# EAGLE design electrode_tester (EAGLE 9.1.3)
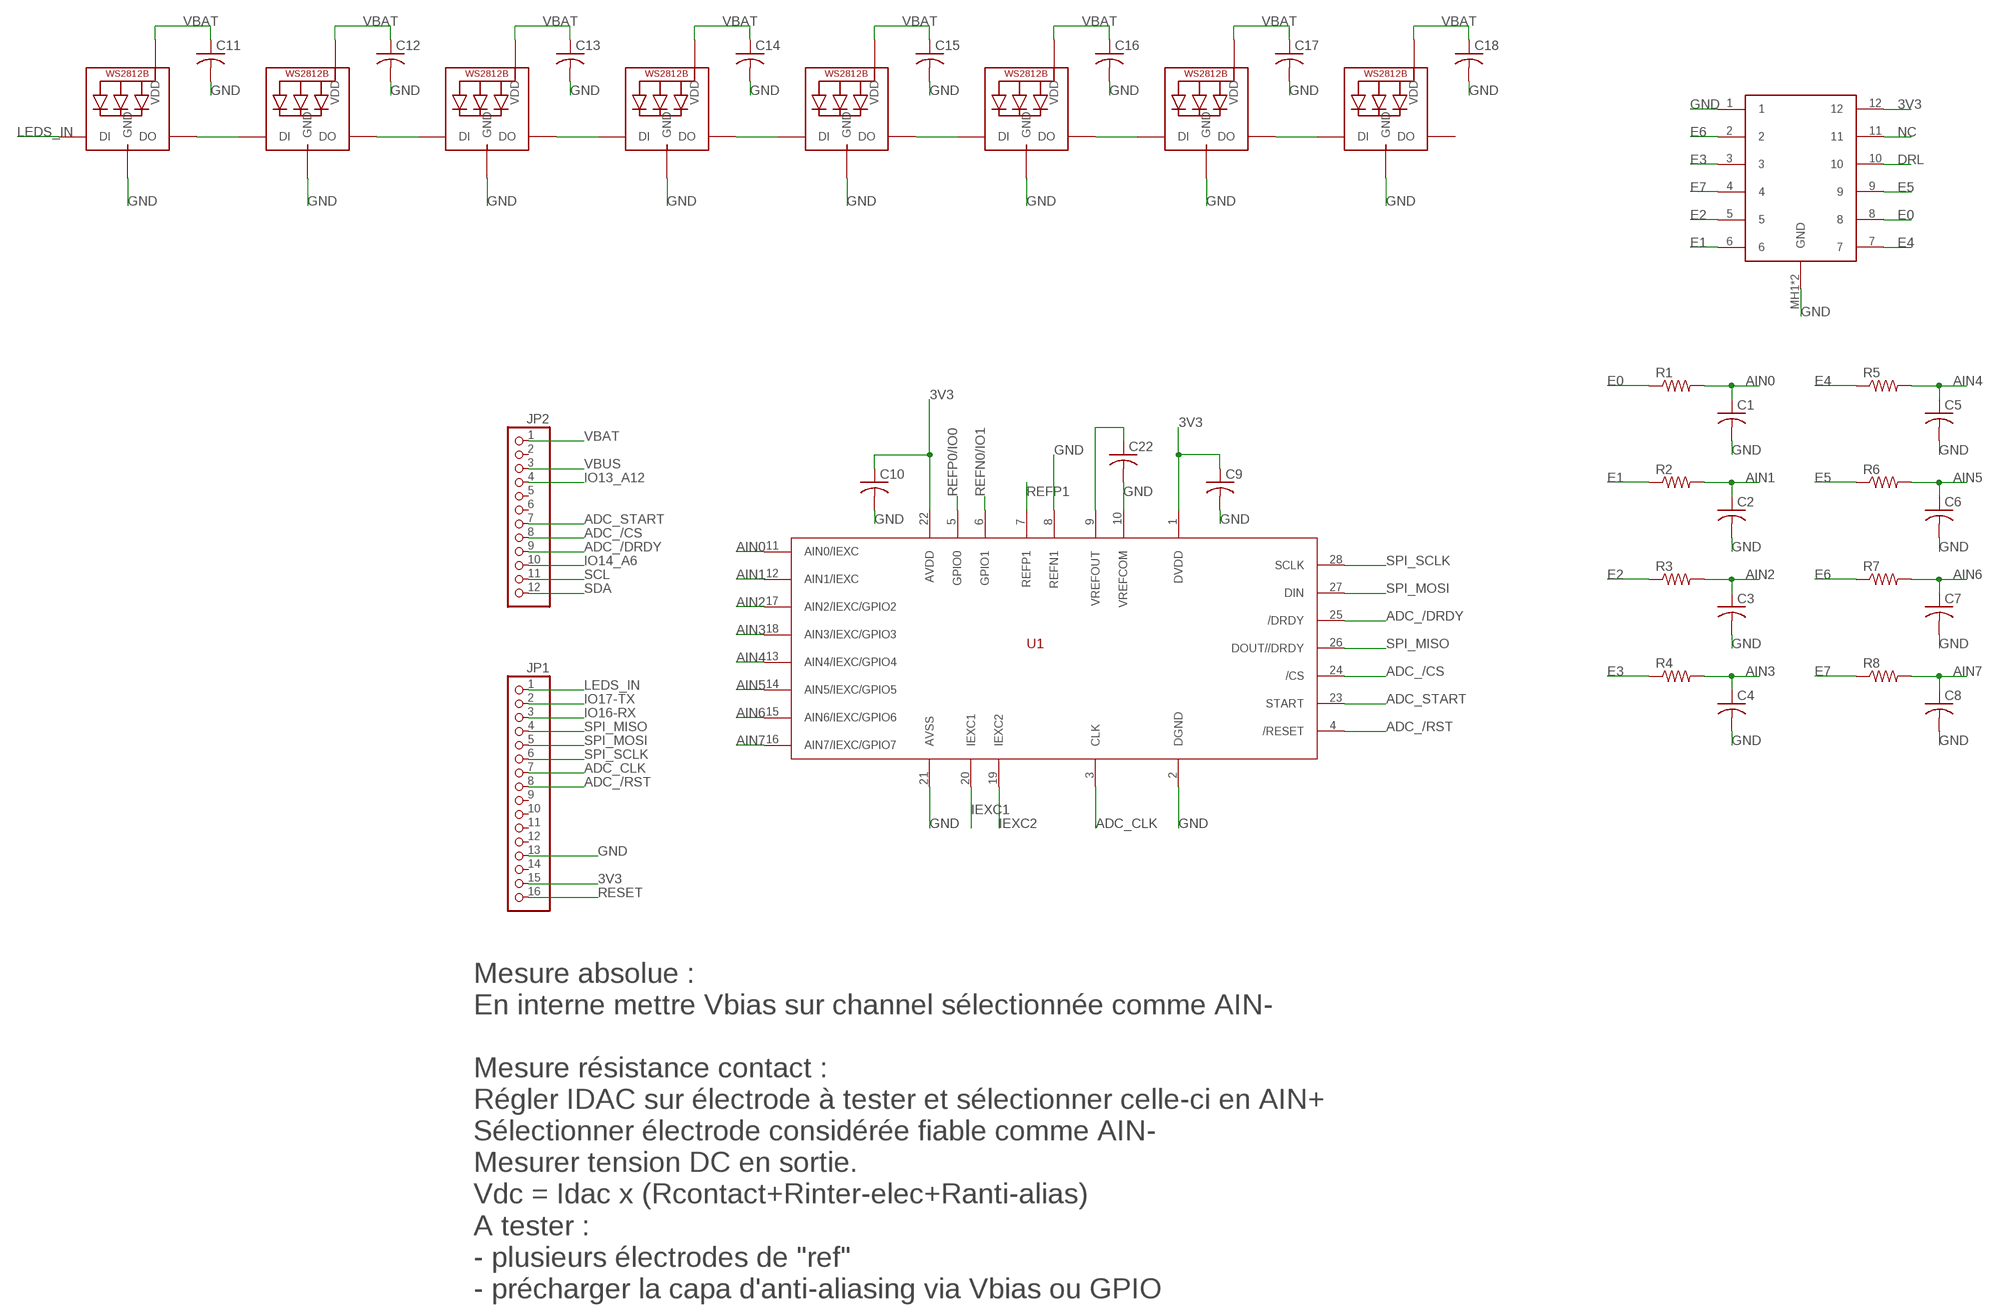
[diagram p0: schematic, sheet 1, part 1 of 2]
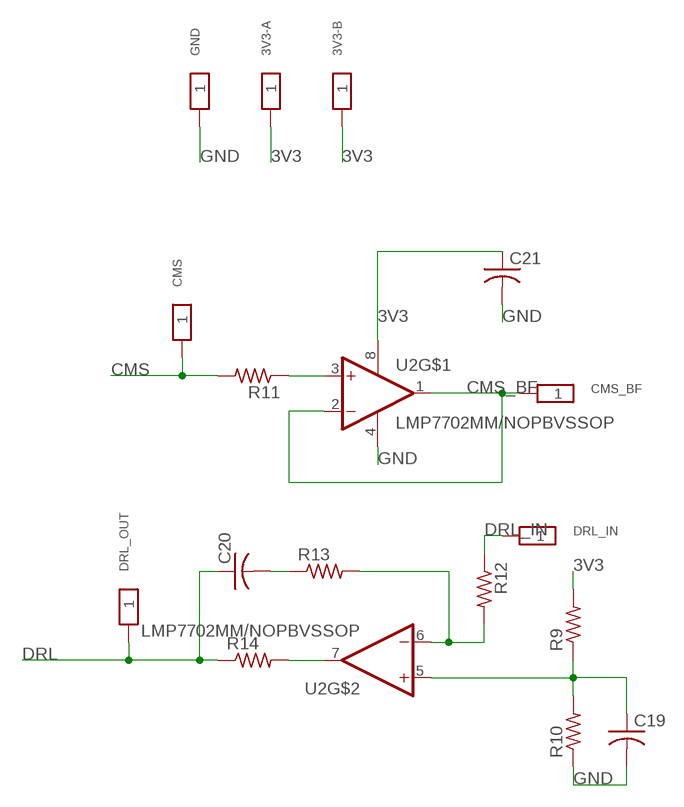
[diagram p1: schematic, sheet 1, part 2 of 2]

## Parts
3V3-A  TESTPAD_PROG  [TP1.5MM]
3V3-B  TESTPAD_PROG  [TP1.5MM]
C1  C-USC0603  [C0603]
C2  C-USC0603  [C0603]
C3  C-USC0603  [C0603]
C4  C-USC0603  [C0603]
C5  C-USC0603  [C0603]
C6  C-USC0603  [C0603]
C7  C-USC0603  [C0603]
C8  C-USC0603  [C0603]
C9  C-USC0603  [C0603]
C10  C-USC0603  [C0603]
C11  C-USC0603  [C0603]
C12  C-USC0603  [C0603]
C13  C-USC0603  [C0603]
C14  C-USC0603  [C0603]
C15  C-USC0603  [C0603]
C16  C-USC0603  [C0603]
C17  C-USC0603  [C0603]
C18  C-USC0603  [C0603]
C19  C-USC0603  [C0603]
C20  C-USC0603  [C0603]
C21  C-USC0603  [C0603]
C22  C-USC0603  [C0603]
CMS  TESTPAD_PROG  [TP1.5MM]
CMS_BF  TESTPAD_PROG  [TP1.5MM]
CONN1  505110-1292  [505110-1292]
DRL_IN  TESTPAD_PROG  [TP1.5MM]
DRL_OUT  TESTPAD_PROG  [TP1.5MM]
GND  TESTPAD_PROG  [TP1.5MM]
JP1  HEADER-1X16ROUND  [1X16_ROUND]
JP2  HEADER-1X12  [1X12_ROUND]
LED1  WS2812B5050  [WS2812B]
LED2  WS2812B5050  [WS2812B]
LED3  WS2812B5050  [WS2812B]
LED4  WS2812B5050  [WS2812B]
LED5  WS2812B5050  [WS2812B]
LED6  WS2812B5050  [WS2812B]
LED7  WS2812B5050  [WS2812B]
LED8  WS2812B5050  [WS2812B]
R1  R-US_R0603  [R0603]
R2  R-US_R0603  [R0603]
R3  R-US_R0603  [R0603]
R4  R-US_R0603  [R0603]
R5  R-US_R0603  [R0603]
R6  R-US_R0603  [R0603]
R7  R-US_R0603  [R0603]
R8  R-US_R0603  [R0603]
R9  R-US_R0603  [R0603]
R10  R-US_R0603  [R0603]
R11  R-US_R0603  [R0603]
R12  R-US_R0603  [R0603]
R13  R-US_R0603  [R0603]
R14  R-US_R0603  [R0603]
U1  ADS1248  [TSSOP28]
U2  LMP7702MM/NOPBVSSOP  [VSSOP8]

## Nets
3V3: 3V3-A.1 3V3-B.1 C9.1 C10.1 C21.1 CONN1.12 JP1.15 R9.2 U1.1(DVDD) U1.22(AVDD) U2.8(V+)
ADC_/CS: JP2.8 U1.24(/CS)
ADC_/DRDY: JP2.9 U1.25(/DRDY)
ADC_/RST: JP1.8 U1.4(/RESET)
ADC_CLK: JP1.7 U1.3(CLK)
ADC_START: JP2.7 U1.23(START)
AIN0: C1.1 R1.2 U1.11(AIN0/IEXC)
AIN1: C2.1 R2.2 U1.12(AIN1/IEXC)
AIN2: C3.1 R3.2 U1.17(AIN2/IEXC/GPIO2)
AIN3: C4.1 R4.2 U1.18(AIN3/IEXC/GPIO3)
AIN4: C5.1 R5.2 U1.13(AIN4/IEXC/GPIO4)
AIN5: C6.1 R6.2 U1.14(AIN5/IEXC/GPIO5)
AIN6: C7.1 R7.2 U1.15(AIN6/IEXC/GPIO6)
AIN7: C8.1 R8.2 U1.16(AIN7/IEXC/GPIO7)
CMS: CMS.1 R11.2
CMS_BF: CMS_BF.1 U2.1(OUT) U2.2(-IN)
DRL: C20.1 CONN1.10 DRL_OUT.1 R14.1
DRL_IN: DRL_IN.1 R12.1
E0: CONN1.8 R1.1
E1: CONN1.6 R2.1
E2: CONN1.5 R3.1
E3: CONN1.3 R4.1
E4: CONN1.7 R5.1
E5: CONN1.9 R6.1
E6: CONN1.2 R7.1
E7: CONN1.4 R8.1
GND: C1.2 C2.2 C3.2 C4.2 C5.2 C6.2 C7.2 C8.2 C9.2 C10.2 C11.2 C12.2 C13.2 C14.2 C15.2 C16.2 C17.2 C18.2 C19.2 C21.2 C22.2 CONN1.1 CONN1.MH1(GND) CONN1.MH2(GND) GND.1 JP1.13 LED1.3-GND(GND) LED2.3-GND(GND) LED3.3-GND(GND) LED4.3-GND(GND) LED5.3-GND(GND) LED6.3-GND(GND) LED7.3-GND(GND) LED8.3-GND(GND) R10.1 U1.2(DGND) U1.8(REFN1) U1.10(VREFCOM) U1.21(AVSS) U2.4(V-)
IEXC1: U1.20(IEXC1)
IEXC2: U1.19(IEXC2)
IO13_A12: JP2.4
IO14_A6: JP2.10
IO16-RX: JP1.3
IO17-TX: JP1.2
LEDS_IN: JP1.1 LED1.4-DIN(DI)
N$1: LED1.2-DOUT(DO) LED2.4-DIN(DI)
N$2: LED2.2-DOUT(DO) LED3.4-DIN(DI)
N$3: LED3.2-DOUT(DO) LED4.4-DIN(DI)
N$4: LED4.2-DOUT(DO) LED5.4-DIN(DI)
N$5: LED5.2-DOUT(DO) LED6.4-DIN(DI)
N$6: LED6.2-DOUT(DO) LED7.4-DIN(DI)
N$7: LED7.2-DOUT(DO) LED8.4-DIN(DI)
N$8: R11.1 U2.3(+IN)
N$9: C22.1 U1.9(VREFOUT)
N$12: R12.2 R13.2 U2.6(-IN)
N$14: C20.2 R13.1
N$15: R14.2 U2.7(OUT)
N$16: C19.1 R9.1 R10.2 U2.5(+IN)
NC: CONN1.11
REFN0/IO1: U1.6(GPIO1)
REFP0/IO0: U1.5(GPIO0)
REFP1: U1.7(REFP1)
RESET: JP1.16
SCL: JP2.11
SDA: JP2.12
SPI_MISO: JP1.4 U1.26(DOUT//DRDY)
SPI_MOSI: JP1.5 U1.27(DIN)
SPI_SCLK: JP1.6 U1.28(SCLK)
VBAT: C11.1 C12.1 C13.1 C14.1 C15.1 C16.1 C17.1 C18.1 JP2.1 LED1.1-VDD(VDD) LED2.1-VDD(VDD) LED3.1-VDD(VDD) LED4.1-VDD(VDD) LED5.1-VDD(VDD) LED6.1-VDD(VDD) LED7.1-VDD(VDD) LED8.1-VDD(VDD)
VBUS: JP2.3
Unconnected: JP1.9 JP1.10 JP1.11 JP1.12 JP1.14 JP2.2 JP2.5 JP2.6 LED8.2-DOUT(DO)

## Notes on the sheet
- Mesure absolue :
  En interne mettre Vbias sur channel sélectionnée comme AIN-
  
  Mesure résistance contact :
  Régler IDAC sur électrode à tester et sélectionner celle-ci en AIN+
  Sélectionner électrode considérée fiable comme AIN-
  Mesurer tension DC en sortie.
  Vdc = Idac x (Rcontact+Rinter-elec+Ranti-alias)
  A tester : 
  - plusieurs électrodes de "ref"
  - précharger la capa d'anti-aliasing via Vbias ou GPIO

## Library data of the parts
3V3-A 3V3-B CMS CMS_BF DRL_IN DRL_OUT GND = electrode_tester:TESTPAD_PROG: TESTPAD
C1-C22 = electrode_tester:C-US: CAPACITOR, American symbol; SPICEPREFIX: C
CONN1 = electrode_tester:505110-1292
JP1 = electrode_tester:HEADER-1X16: PIN HEADER
JP2 = electrode_tester:HEADER-1X12
LED1-LED8 = electrode_tester:WS2812B
R1-R14 = electrode_tester:R-US_: RESISTOR, American symbol; SPICEPREFIX: R
U1 = electrode_tester:ADS1248
U2 = electrode_tester:LMP7702MM/NOPB: Op Amps Prec RRIO 12V Dual Op Amp; DESCRIPTION: Op Amps Prec RRIO 12V Dual Op Amp; MF: Texas Instruments; MP: LMP7702MM/NOPB; PACKAGE: MSOP-8

## Board
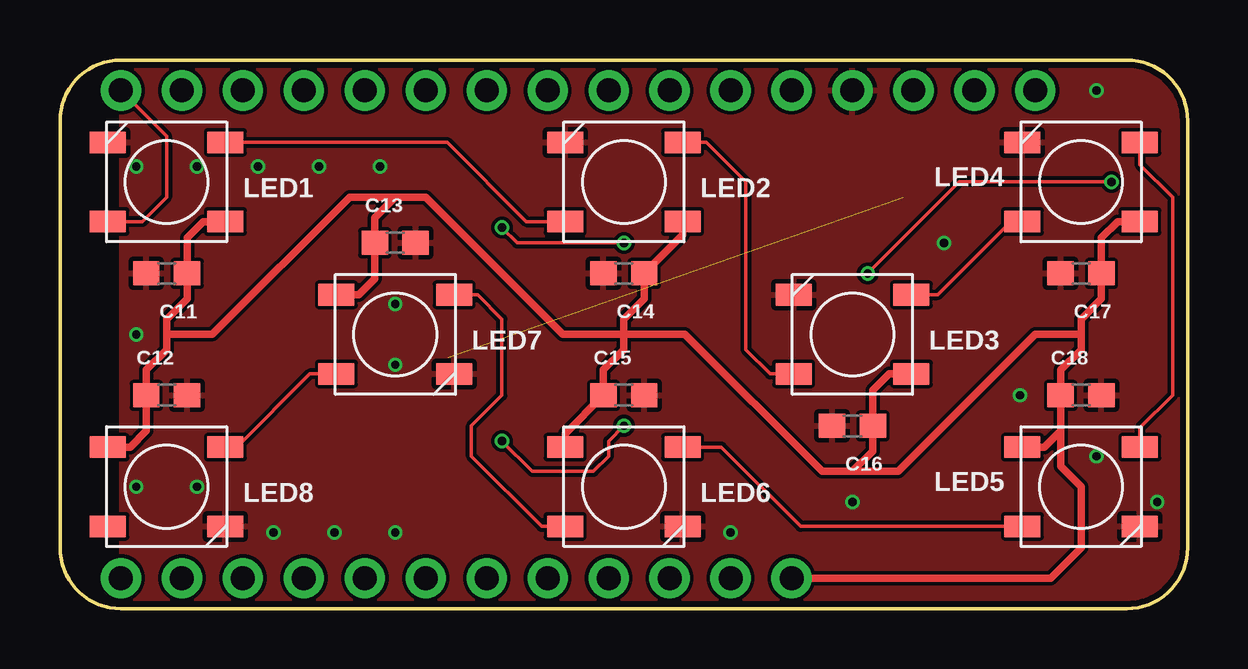
[diagram p2: board, top side]
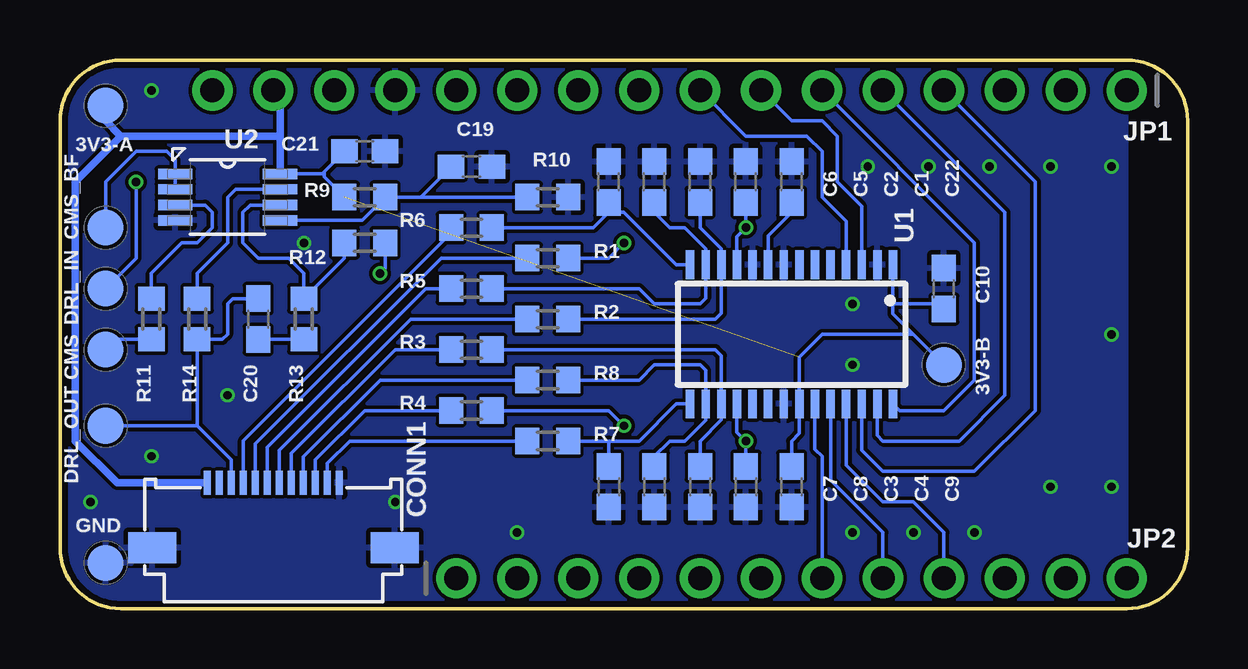
[diagram p3: board, bottom side, seen from below]

Size 46.99 x 22.86 mm. Coordinates in mm from the lower left corner, seen from the top.
Outline: 2.54,0 arc-90 0,2.54 0,20.32 arc-90 2.54,22.86 44.45,22.86 arc-90 46.99,20.32 46.99,2.54 arc-90 44.45,0 2.54,0
Copper layers (1*16): Top 0.018mm / dielectric 1.55mm / Bottom 0.018mm
Design rules "eC_2Layer_PClass6_BaseCopperO18_eCDefault": minimum track width 0.15mm, minimum drill 0.35mm, track to track 0.15mm, track to pad 0.15mm, pad to pad 0.15mm, via to via 0.15mm, smd to smd 0mil, copper to edge 0.25mm, drill to drill 0.35mm, minimum pad ring 0.175mm, minimum via ring 0.125mm, stop-mask expansion 0mil, vias tented up to drill 0.45mm, thermal gap 0.2mm

### Footprints (pad centres in the part's own frame; a part is rotated, then mirrored left to right if it is on the bottom)
TP1.5MM = smd 1.5 x 1.5: 1 0,0
C0603 = smd 1.1 x 1: 1 -0.85,0; 2 0.85,0
505110-1292 = smd 0.3 x 1: 1 -2.75,-2.7; 2 -2.25,-2.7; 3 -1.75,-2.7; 4 -1.25,-2.7; 5 -0.75,-2.7; 6 -0.25,-2.7; 7 0.25,-2.7; 8 0.75,-2.7; 9 1.25,-2.7; 10 1.75,-2.7; 11 2.25,-2.7; 12 2.75,-2.7 | smd 2 x 1.3: MH1 -5.05,0; MH2 5.05,0
1X16_ROUND = drill 1 pad 1.676: 1 -19.05,0; 2 -16.51,0; 3 -13.97,0; 4 -11.43,0; 5 -8.89,0; 6 -6.35,0; 7 -3.81,0; 8 -1.27,0; 9 1.27,0; 10 3.81,0; 11 6.35,0; 12 8.89,0; 13 11.43,0; 14 13.97,0; 15 16.51,0; 16 19.05,0
1X12_ROUND = drill 1 pad 1.676: 1 -13.97,0; 2 -11.43,0; 3 -8.89,0; 4 -6.35,0; 5 -3.81,0; 6 -1.27,0; 7 1.27,0; 8 3.81,0; 9 6.35,0; 10 8.89,0; 11 11.43,0; 12 13.97,0
WS2812B = smd 1.5 x 0.9: 1-VDD 2.45,-1.65; 2-DOUT 2.45,1.65; 3-GND -2.45,1.65; 4-DIN -2.45,-1.65
R0603 = smd 1 x 1.1: 1 -0.85,0; 2 0.85,0
TSSOP28 = smd 0.35 x 1.2: 1 -4.225,-2.9; 2 -3.575,-2.9; 3 -2.925,-2.9; 4 -2.275,-2.9; 5 -1.625,-2.9; 6 -0.975,-2.9; 7 -0.325,-2.9; 8 0.325,-2.9; 9 0.975,-2.9; 10 1.625,-2.9; 11 2.275,-2.9; 12 2.925,-2.9; 13 3.575,-2.9; 14 4.225,-2.9; 15 4.225,2.9; 16 3.575,2.9; 17 2.925,2.9; 18 2.275,2.9; 19 1.625,2.9; 20 0.975,2.9; 21 0.325,2.9; 22 -0.325,2.9; 23 -0.975,2.9; 24 -1.625,2.9; 25 -2.275,2.9; 26 -2.925,2.9; 27 -3.575,2.9; 28 -4.225,2.9
VSSOP8 = smd 1.422 x 0.432: 1 -2.184,0.965; 2 -2.184,0.33; 3 -2.184,-0.33; 4 -2.184,-0.965; 5 2.184,-0.965; 6 2.184,-0.33; 7 2.184,0.33; 8 2.184,0.965

### Placement (x,y rotation side)
3V3-A  45.09,20.95 0 bottom
3V3-B  10.16,10.16 0 bottom
C1  18.42,17.78 90 bottom
C2  20.32,17.78 90 bottom
C3  20.32,5.08 270 bottom
C4  18.42,5.08 270 bottom
C5  22.23,17.78 90 bottom
C6  24.13,17.78 90 bottom
C7  24.13,5.08 270 bottom
C8  22.23,5.08 270 bottom
C9  16.51,5.08 270 bottom
C10  10.16,13.34 90 bottom
C11  4.45,13.97 180 top
C12  4.45,8.89 0 top
C13  13.97,15.24 0 top
C14  23.5,13.97 180 top
C15  23.5,8.89 0 top
C16  33.02,7.62 180 top
C17  42.54,13.97 180 top
C18  42.54,8.89 0 top
C19  29.85,18.41 0 bottom
C20  38.73,12.06 270 bottom
C21  34.29,19.05 0 bottom
C22  16.51,17.78 90 bottom
CMS  45.09,10.79 0 bottom
CMS_BF  45.09,15.88 0 bottom
CONN1  38.1,2.54 180 bottom
DRL_IN  45.09,13.34 0 bottom
DRL_OUT  45.09,7.62 0 bottom
GND  45.09,1.91 0 bottom
JP1  21.59,21.59 180 bottom
JP2  16.51,1.27 0 bottom
LED1  4.45,17.78 0 top
LED2  23.5,17.78 0 top
LED3  33.02,11.43 0 top
LED4  42.54,17.78 0 top
LED5  42.54,5.08 180 top
LED6  23.5,5.08 180 top
LED7  13.97,11.43 180 top
LED8  4.45,5.08 180 top
R1  26.67,14.61 0 bottom
R2  26.67,12.06 0 bottom
R3  29.85,10.79 0 bottom
R4  29.85,8.26 0 bottom
R5  29.85,13.34 0 bottom
R6  29.85,15.88 0 bottom
R7  26.67,6.99 0 bottom
R8  26.67,9.53 0 bottom
R9  34.29,17.14 180 bottom
R10  26.67,17.14 180 bottom
R11  43.18,12.06 270 bottom
R12  34.29,15.24 180 bottom
R13  36.83,12.06 90 bottom
R14  41.27,12.06 90 bottom
U1  16.51,11.43 180 bottom
U2  40,17.14 0 bottom

### Tracks (layer width: path | path; a pad name or v marks a point on that pad's centre or on a via)
3V3  (1 unrouted)
  Bottom 0.152: 36.08,18.11 U2.8 36.08,18.11 | 36.08,18.11 35.98,18.2 | 35.98,18.2 C21.1 | 35.98,18.2 35.98,17.99 R9.2 | U1.1 12.28,12.7 | 12.28,12.7 12.28,12.29 11.43,11.43 | 11.43,11.43 15.24,11.43 16.19,10.48 U1.22 16.19,7.31 16.51,6.99 C9.1 | 11.43,11.43 3V3-B.1 | C10.1 10.38,12.7 12.28,12.7
  Bottom 0.305: CONN1.12 44.61,5.24 46.35,6.99 46.35,17.78 | 46.35,17.78 44.45,19.68 | 37.82,19.68 38.1,19.68 | 38.1,19.68 44.45,19.68 | 37.82,19.68 U2.8 | 44.45,19.68 45.09,20.32 | 45.09,20.32 3V3-A.1 | 37.82,19.68 44.45,19.68 | 37.82,19.68 U2.8 | 46.35,17.78 44.45,19.68 | 44.45,19.68 45.09,20.32 | 37.82,19.68 U2.8 | 37.82,19.68 38.1,19.68 | 38.1,19.68 44.45,19.68 | 37.82,19.68 44.45,19.68 | 37.82,19.68 37.82,21.31 JP1.15
ADC_/CS
  Bottom 0.152: U1.24 14.88,5.36 12.7,3.17 JP2.8
ADC_/DRDY
  Bottom 0.152: U1.25 14.24,5.98 12.7,4.45 11.43,4.45 10.16,3.17 JP2.9
ADC_/RST
  Bottom 0.152: U1.4 14.24,16.14 15.24,17.14 15.24,19.05 15.87,19.68 18.42,19.68 JP1.8
ADC_CLK
  Bottom 0.152: U1.3 13.58,16.76 14.6,17.78 14.6,19.68 15.24,20.32 16.51,20.32 JP1.7
ADC_START
  Bottom 0.152: U1.23 15.53,6.64 15.24,6.35 JP2.7
AIN0  (via drill 0.35)
  Top 0.152: v18.42,15.88 19.05,15.24 v23.5,15.24
  Bottom 0.152: U1.11 18.79,15.51 v18.42,15.88 C1.1 | v23.5,15.24 24.13,14.61 R1.2
AIN1
  Bottom 0.152: R2.2 19.69,12.06 19.44,12.31 U1.12 19.44,14.99 20.32,15.88 C2.1
AIN2
  Bottom 0.152: R3.2 19.69,10.79 19.44,10.54 U1.17 19.44,7.87 20.32,6.99 C3.1
AIN3  (via drill 0.35)
  Top 0.152: v18.42,6.99 19.69,5.71 20.96,5.71 22.23,5.71 22.86,6.35 22.86,6.99 v23.5,7.62
  Bottom 0.152: U1.18 18.79,7.36 v18.42,6.99 C4.1 | v23.5,7.62 24.13,8.26 R4.2
AIN4
  Bottom 0.152: R5.2 22.86,13.34 22.23,12.7 20.32,12.7 20.09,12.94 U1.13 20.09,15.01 20.96,15.88 21.59,15.88 22.23,16.51 C5.1
AIN5
  Bottom 0.152: R6.2 24.77,15.88 24.13,16.51 C6.1 23.71,16.51 23.5,16.51 21.32,14.33 U1.14
AIN6
  Bottom 0.152: R7.2 24.13,6.99 | 24.13,6.99 22.86,6.99 21.32,8.53 U1.15 | C7.1 24.13,6.99
AIN7
  Bottom 0.152: R8.2 22.86,9.53 22.23,10.16 20.32,10.16 20.09,9.93 U1.16 20.09,7.86 20.96,6.99 21.59,6.99 22.23,6.35 C8.1
CMS
  Bottom 0.152: R11.2 44.66,11.21 CMS.1
CMS_BF
  Bottom 0.152: U2.2 U2.1 42.19,18.69 42.54,19.05 43.81,19.05 45.09,17.78 CMS_BF.1
DRL
  Bottom 0.152: CONN1.10 39.85,6.2 41.27,7.62 | DRL_OUT.1 41.27,7.62 | 41.27,7.62 R14.1 40.22,11.21 40,11.43 40,12.7 39.79,12.91 C20.1
DRL_IN  (via drill 0.35)
  Top 0.152: v43.81,17.78 37.46,17.78 v33.66,13.97
  Bottom 0.152: v33.66,13.97 33.44,14.19 R12.1 | DRL_IN.1 43.81,14.61 v43.81,17.78
E0
  Bottom 0.152: R1.1 31.11,14.61 38.85,6.87 CONN1.8
E1
  Bottom 0.152: CONN1.6 37.85,6.6 32.38,12.06 R2.1
E2
  Bottom 0.152: CONN1.5 37.35,6.46 33.02,10.79 R3.1
E3
  Bottom 0.152: CONN1.3 36.35,6.2 34.29,8.26 R4.1
E4
  Bottom 0.152: R5.1 31.75,13.34 38.35,6.74 CONN1.7
E5
  Bottom 0.152: R6.1 30.7,15.46 30.9,15.46 39.35,7 CONN1.9
E6
  Bottom 0.152: CONN1.2 35.85,6.06 34.92,6.99 R7.1
E7
  Bottom 0.152: CONN1.4 36.85,6.33 33.66,9.53 R8.1
GND  (via drill 0.35)
  other vias: 13.97,10.16 13.97,12.7 13.97,3.17 11.43,3.17 10.79,18.41 8.25,18.41 8.89,3.17 3.18,18.41 3.18,11.43 5.71,18.41 43.18,21.59 36.83,15.24 40,8.89 43.18,6.35 13.33,18.41 3.18,5.08 5.71,5.08 33.02,4.45 27.94,3.17 45.72,4.45
  pour Bottom: 47.62,23.5 2.54,23.5 2.54,-0.64 47.62,-0.64
  pour Top: 47.62,23.5 47.62,-0.64 2.54,-0.64 2.54,23.5
LEDS_IN
  Top 0.152: LED1.4-DIN 3.43,16.13 4.45,17.14 4.45,19.68 JP1.1
N$1
  Top 0.152: LED1.2-DOUT 16.13,19.43 19.43,16.13 LED2.4-DIN
N$2
  Top 0.152: LED2.2-DOUT 26.93,19.43 28.57,17.78 28.57,10.79 29.59,9.78 LED3.4-DIN
N$3
  Top 0.152: LED4.4-DIN 40.09,15.96 39.46,15.96 36.57,13.08 LED3.2-DOUT
N$4
  Top 0.152: LED4.2-DOUT 44.99,18.5 46.35,17.14 46.35,8.89 44.99,7.53 LED5.4-DIN
N$5
  Top 0.152: LED5.2-DOUT 30.86,3.43 27.56,6.73 LED6.4-DIN
N$6
  Top 0.152: LED6.2-DOUT 20.07,3.43 17.14,6.35 17.14,7.62 18.42,8.89 18.42,12.06 17.4,13.08 LED7.4-DIN
N$7
  Top 0.152: LED7.2-DOUT 10.41,9.78 7.37,6.73 LED8.4-DIN
N$8
  Bottom 0.152: U2.3 40.95,16.82 40.64,16.51 40.64,15.88 41.27,15.24 41.91,15.24 43.18,13.97 R11.1
N$9
  Bottom 0.152: U1.9 17.49,15.54 16.51,16.51 C22.1
N$12
  Bottom 0.152: R12.2 35.14,14.61 R13.2 36.83,13.97 37.46,14.61 38.73,14.61 39.37,15.24 39.37,16.51 39.06,16.82 U2.6
N$14
  Bottom 0.152: C20.2 R13.1
N$15
  Bottom 0.152: U2.7 39.67,17.48 40,17.14 40,15.24 41.27,13.97 R14.2
N$16
  Bottom 0.152: 31.96,17.14 R9.1 34.41,16.18 U2.5 | 31.96,17.14 R10.2 | C19.1 31.96,17.14
SPI_MISO
  Bottom 0.152: U1.26 13.58,6.6 12.7,5.71 8.89,5.71 6.35,8.26 6.35,17.78 JP1.4
SPI_MOSI
  Bottom 0.152: U1.27 12.94,7.22 12.7,6.99 9.53,6.99 7.62,8.89 7.62,16.51 JP1.5
SPI_SCLK
  Bottom 0.152: U1.28 12.01,8.26 10.16,8.26 8.89,9.53 8.89,15.24 JP1.6
VBAT
  Top 0.305: 23.5,11.43 20.96,11.43 15.24,17.14 13.97,17.14 | 23.5,11.43 26.04,11.43 31.75,5.71 33.02,5.71 | 33.02,5.71 34.92,5.71 40.64,11.43 42.54,11.43 | 13.97,17.14 12.06,17.14 6.35,11.43 4.45,11.43 | 4.45,11.43 4.45,12.06 5.29,12.91 C11.1 5.29,15.46 5.97,16.13 LED1.1-VDD | 4.45,11.43 4.45,10.79 3.6,9.95 C12.1 3.6,7.41 2.92,6.73 LED8.1-VDD | 23.5,11.43 23.5,12.06 24.35,12.91 C14.1 25.95,15.57 LED2.1-VDD | 23.5,11.43 23.5,10.79 22.64,9.95 C15.1 21.05,7.29 LED6.1-VDD | 42.54,11.43 42.54,12.06 43.39,12.91 C17.1 43.39,15.46 44.07,16.13 LED4.1-VDD | 42.54,11.43 42.54,10.79 41.7,9.95 C18.1 41.7,7.41 | 13.97,17.14 13.12,16.3 C13.1 13.12,13.76 12.44,13.08 LED7.1-VDD | 33.02,5.71 33.87,6.57 C16.1 33.87,9.11 34.54,9.78 LED3.1-VDD | LED5.1-VDD 41.02,6.73 41.7,7.41 | 41.7,7.41 41.7,5.93 42.54,5.08 42.54,2.54 41.27,1.27 JP2.1